# EAGLE design Enclosure 100x68 (EAGLE 9.6.1)
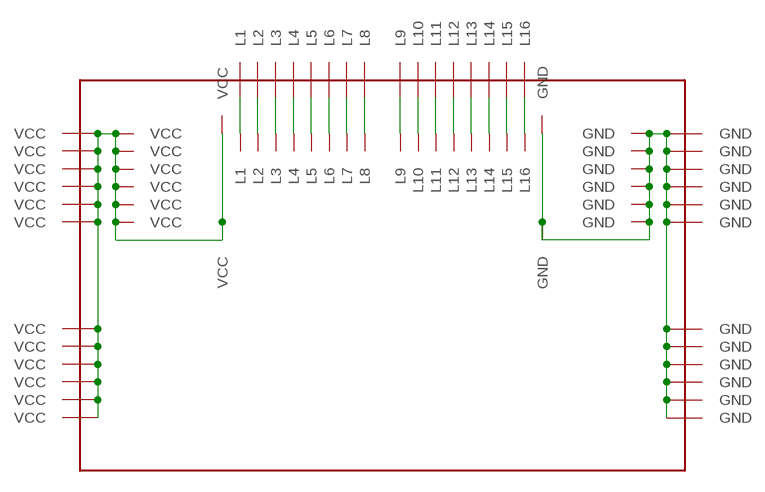
[diagram p0: schematic, sheet 1]

## Parts
P1  PROTO-34X22-BAT  [PROTO-34X22-BAT]

## Nets
GND: P1.P28-19(GND) P1.P32-16(GND) P1.P33-13(GND) P1.P33-14(GND) P1.P33-15(GND) P1.P33-16(GND) P1.P33-17(GND) P1.P33-18(GND) P1.P34-05(GND) P1.P34-06(GND) P1.P34-07(GND) P1.P34-08(GND) P1.P34-09(GND) P1.P34-10(GND) P1.P34-13(GND) P1.P34-14(GND) P1.P34-15(GND) P1.P34-16(GND) P1.P34-17(GND) P1.P34-18(GND)
N$1: P1.P10-21(L1) P1.P10-22(L1)
N$2: P1.P11-21(L2) P1.P11-22(L2)
N$3: P1.P12-21(L3) P1.P12-22(L3)
N$4: P1.P13-21(L4) P1.P13-22(L4)
N$5: P1.P14-21(L5) P1.P14-22(L5)
N$6: P1.P15-21(L6) P1.P15-22(L6)
N$7: P1.P16-21(L7) P1.P16-22(L7)
N$8: P1.P17-21(L8) P1.P17-22(L8)
N$9: P1.P18-21(L9) P1.P18-22(L9)
N$10: P1.P19-21(L10) P1.P19-22(L10)
N$11: P1.P20-21(L11) P1.P20-22(L11)
N$12: P1.P21-21(L12) P1.P21-22(L12)
N$13: P1.P22-21(L13) P1.P22-22(L13)
N$14: P1.P23-21(L14) P1.P23-22(L14)
N$15: P1.P24-21(L15) P1.P24-22(L15)
N$16: P1.P25-21(L16) P1.P25-22(L16)
VCC: P1.P01-05(VCC) P1.P01-06(VCC) P1.P01-07(VCC) P1.P01-08(VCC) P1.P01-09(VCC) P1.P01-10(VCC) P1.P01-13(VCC) P1.P01-14(VCC) P1.P01-15(VCC) P1.P01-16(VCC) P1.P01-17(VCC) P1.P01-18(VCC) P1.P02-13(VCC) P1.P02-14(VCC) P1.P02-15(VCC) P1.P02-16(VCC) P1.P02-17(VCC) P1.P02-18(VCC) P1.P03-16(VCC) P1.P06-19(VCC)

## Library data of the parts
P1 = digitalconcepts:PROTO-34X22-BAT: 34 x 22 Prototyping board, with battery connection (GND + Vcc plane), coupled side connection and Raspberry Pi Zero standoff mounting points, to fit a 100 x 68 enclosure

## Board
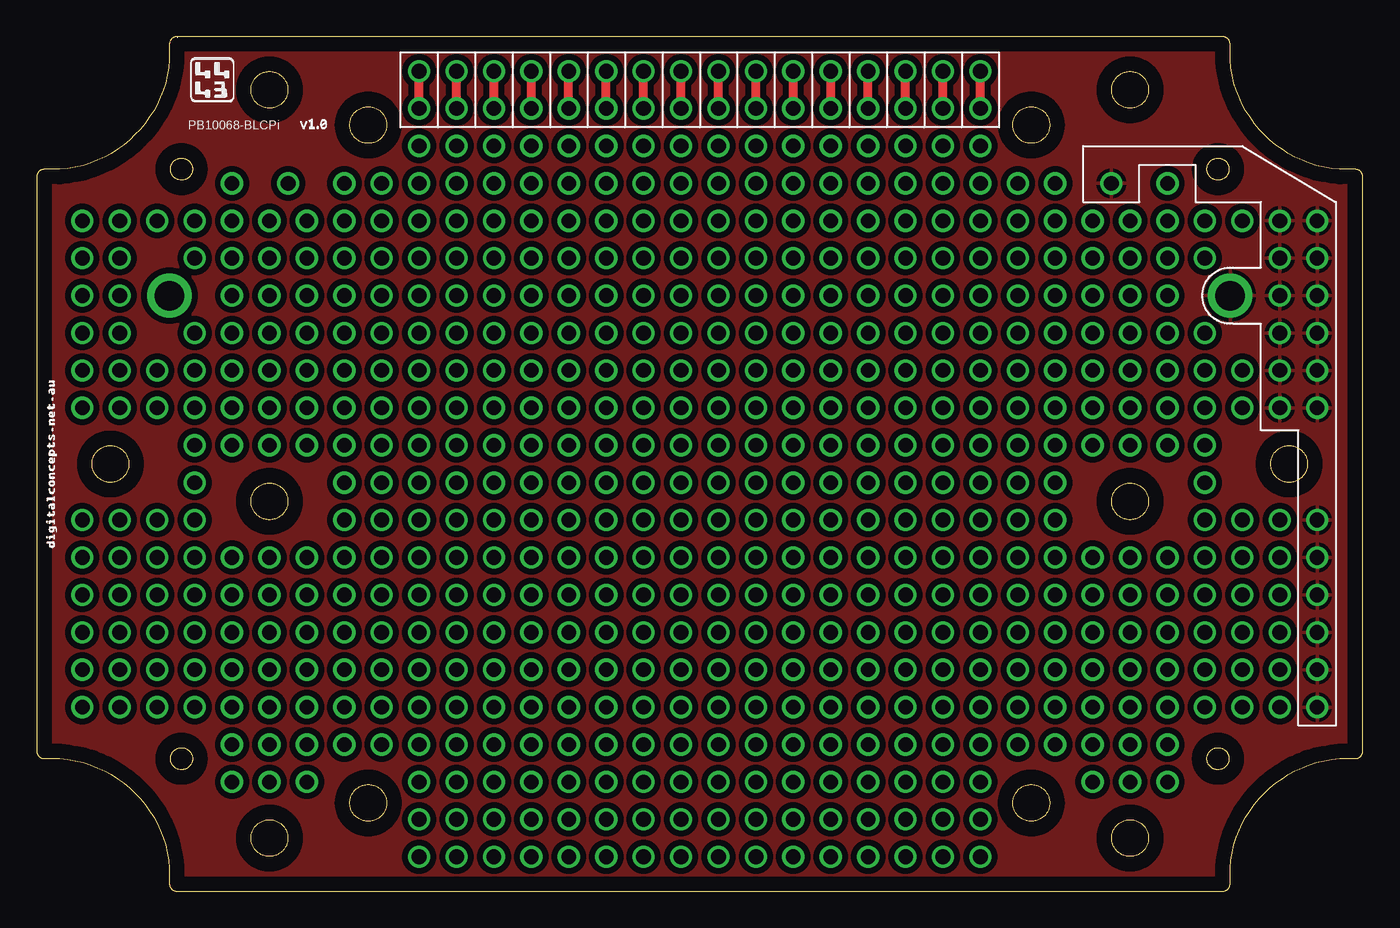
[diagram p1: board, top side]
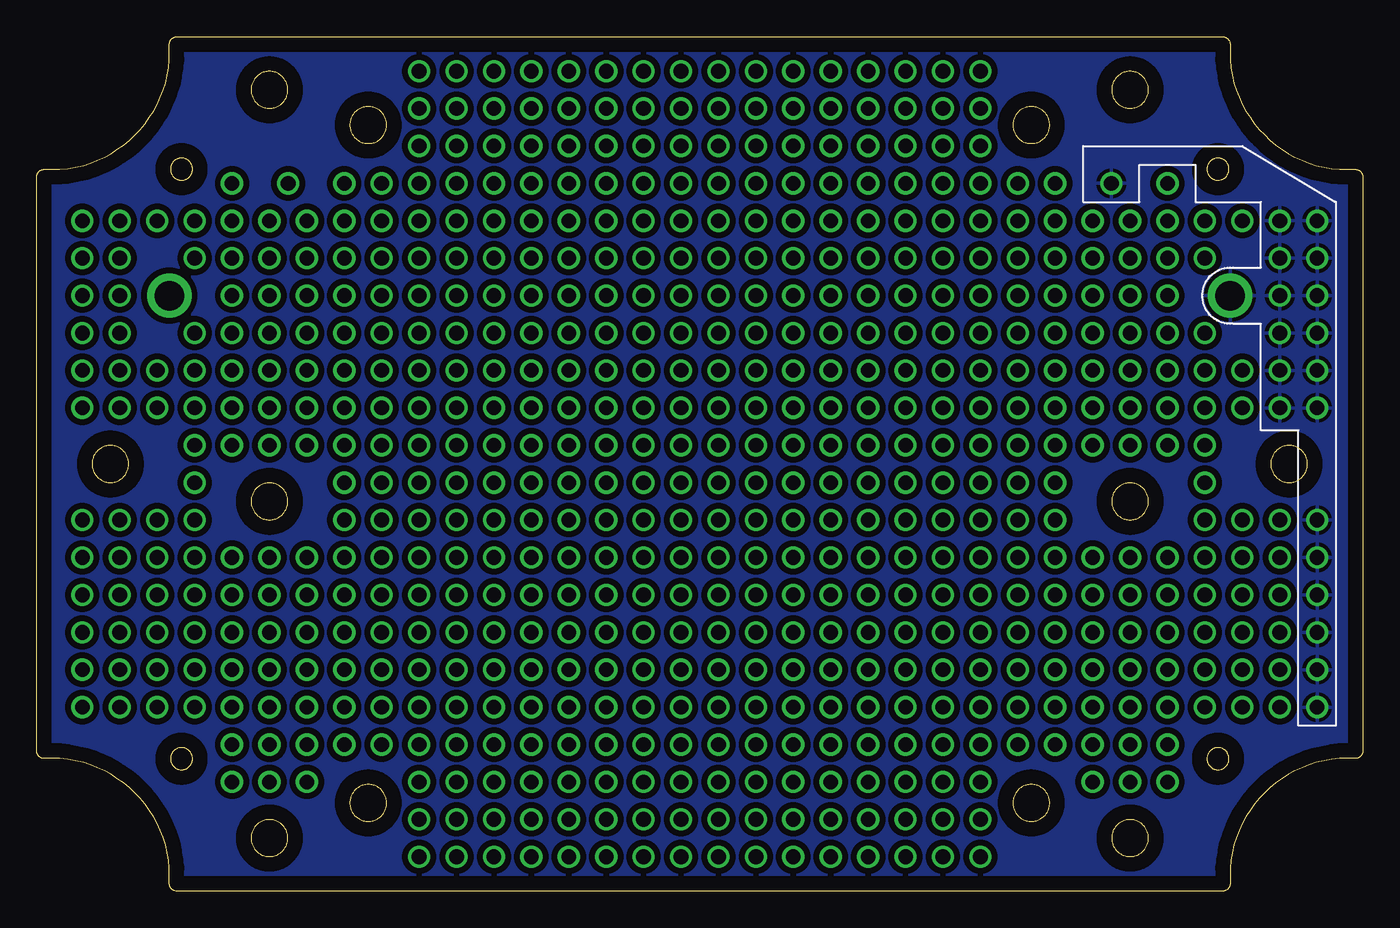
[diagram p2: board, bottom side, seen from below]

Size 90 x 58 mm. Coordinates in mm from the lower left corner, seen from the top.
Outline: 9.4,57.99 9.37,57.98 9.34,57.97 9.31,57.96 9.28,57.95 9.25,57.93 9.22,57.91 9.19,57.9 9.17,57.88 9.15,57.85 9.12,57.83 9.1,57.81 9.09,57.78 9.07,57.75 9.05,57.72 9.03,57.66 9.02,57.63 9.01,57.6 9,57.57 9,57.53 9,56.45 8.94,55.91 8.84,55.39 8.73,54.87 8.57,54.36 8.37,53.89 8.17,53.41 7.92,52.95 7.63,52.53 7.35,52.1 7.02,51.7 6.66,51.34 6.29,50.98 5.9,50.65 5.47,50.37 5.05,50.08 4.59,49.83 4.11,49.63 3.64,49.43 3.13,49.27 2.61,49.16 2.09,49.06 1.55,49 0.46,49 0.43,49 0.4,48.99 0.37,48.98 0.33,48.97 0.3,48.96 0.27,48.95 0.25,48.93 0.22,48.91 0.19,48.9 0.17,48.88 0.15,48.85 0.12,48.83 0.1,48.81 0.08,48.78 0.07,48.75 0.05,48.72 0.04,48.69 0.03,48.66 0.02,48.63 0.01,48.6 0,48.57 0,48.53 0,9.46 0,9.43 0.01,9.4 0.02,9.37 0.03,9.33 0.04,9.3 0.05,9.28 0.07,9.25 0.08,9.22 0.1,9.19 0.12,9.17 0.17,9.12 0.19,9.1 0.22,9.09 0.25,9.07 0.27,9.05 0.3,9.04 0.33,9.03 0.37,9.02 0.4,9.01 0.43,9 0.46,9 1.55,9 2.09,8.94 2.61,8.84 3.13,8.73 3.64,8.57 4.11,8.37 4.59,8.17 5.05,7.92 5.47,7.63 5.9,7.35 6.29,7.02 6.66,6.66 7.02,6.29 7.35,5.9 7.63,5.47 7.92,5.05 8.17,4.59 8.37,4.11 8.57,3.64 8.73,3.13 8.84,2.61 8.94,2.09 9,1.55 9,0.46 9,0.43 9.01,0.4 9.02,0.37 9.03,0.33 9.04,0.31 9.05,0.28 9.07,0.25 9.09,0.22 9.1,0.19 9.12,0.17 9.15,0.15 9.17,0.12 9.19,0.1 9.25,0.07 9.28,0.05 9.31,0.04 9.34,0.03 9.37,0.02 9.4,0.01 9.43,0 9.47,0 80.53,0 80.57,0 80.63,0.02 80.66,0.03 80.69,0.04 80.72,0.05 80.75,0.07 80.78,0.08 80.81,0.1 80.83,0.12 80.85,0.15 80.88,0.17 80.9,0.19 80.91,0.22 80.93,0.25 80.95,0.28 80.96,0.31 80.97,0.33 80.98,0.37 80.99,0.4 81,0.43 81,0.47 81,1.55 81.06,2.09 81.16,2.61 81.27,3.13 81.43,3.64 81.63,4.11 81.83,4.59 82.08,5.05 82.37,5.47 82.65,5.9 82.98,6.3 83.34,6.66 83.7,7.02 84.1,7.35 84.53,7.63 84.95,7.92 85.41,8.17 85.89,8.37 86.36,8.57 86.87,8.73 87.39,8.84 87.91,8.94 88.45,9 89.53,9 89.57,9 89.6,9.01 89.63,9.02 89.66,9.03 89.69,9.04 89.72,9.05 89.75,9.07 89.78,9.09 89.81,9.1 89.83,9.12 89.85,9.15 89.88,9.17 89.9,9.19 89.91,9.22 89.93,9.25 89.95,9.28 89.96,9.31 89.97,9.34 89.98,9.37 89.99,9.4 90,9.43 90,9.47 90,48.53 90,48.57 89.99,48.6 89.98,48.63 89.97,48.66 89.96,48.69 89.95,48.72 89.93,48.75 89.91,48.78 89.9,48.81 89.88,48.83 89.85,48.85 89.83,48.88 89.81,48.9 89.78,48.91 89.75,48.93 89.72,48.95 89.69,48.96 89.66,48.97 89.63,48.98 89.6,48.99 89.57,49 89.53,49 88.45,49 87.91,49.06 87.39,49.16 86.87,49.27 86.36,49.43 85.89,49.63 85.41,49.83 84.95,50.08 84.53,50.37 84.1,50.65 83.7,50.98 82.98,51.7 82.65,52.1 82.37,52.53 82.08,52.95 81.83,53.41 81.63,53.89 81.43,54.36 81.27,54.87 81.16,55.39 81.06,55.91 81,56.45 81,57.53 81,57.57 80.99,57.6 80.98,57.63 80.97,57.66 80.96,57.69 80.95,57.72 80.93,57.75 80.91,57.78 80.9,57.81 80.88,57.83 80.85,57.85 80.83,57.88 80.81,57.9 80.78,57.91 80.75,57.93 80.72,57.95 80.69,57.96 80.66,57.97 80.63,57.98 80.6,57.99 80.57,58 80.53,58 9.47,58 9.43,58 9.4,57.99
Outline: 15.54,2.37 15.46,2.39 15.38,2.42 15.3,2.45 15.23,2.48 15.16,2.52 15.09,2.56 15.02,2.61 14.96,2.66 14.91,2.72 14.85,2.77 14.8,2.83 14.75,2.9 14.71,2.97 14.67,3.04 14.64,3.11 14.61,3.19 14.58,3.27 14.56,3.35 14.55,3.43 14.54,3.51 14.54,3.69 14.55,3.77 14.56,3.85 14.58,3.93 14.61,4.01 14.64,4.09 14.67,4.16 14.71,4.23 14.75,4.3 14.8,4.36 14.85,4.43 14.91,4.48 14.96,4.54 15.02,4.59 15.09,4.64 15.16,4.68 15.23,4.72 15.3,4.75 15.38,4.78 15.46,4.81 15.54,4.82 15.62,4.84 15.7,4.85 15.88,4.85 15.96,4.84 16.04,4.82 16.12,4.81 16.2,4.78 16.28,4.75 16.35,4.72 16.42,4.68 16.49,4.64 16.55,4.59 16.62,4.54 16.67,4.48 16.73,4.43 16.78,4.36 16.83,4.3 16.87,4.23 16.91,4.16 16.94,4.09 16.97,4.01 17,3.93 17.01,3.85 17.03,3.77 17.04,3.69 17.04,3.51 17.03,3.43 17.01,3.35 17,3.27 16.97,3.19 16.94,3.11 16.91,3.04 16.87,2.97 16.83,2.9 16.78,2.83 16.73,2.77 16.67,2.72 16.62,2.66 16.55,2.61 16.49,2.56 16.42,2.52 16.35,2.48 16.28,2.45 16.2,2.42 16.12,2.39 16.04,2.37 15.96,2.36 15.88,2.35 15.7,2.35 15.62,2.36 15.54,2.37
Outline: 74.46,4.82 74.54,4.81 74.62,4.78 74.7,4.75 74.77,4.72 74.84,4.68 74.91,4.64 74.97,4.59 75.04,4.54 75.15,4.43 75.2,4.36 75.25,4.3 75.29,4.23 75.33,4.16 75.36,4.09 75.39,4.01 75.42,3.93 75.43,3.85 75.45,3.77 75.46,3.69 75.46,3.51 75.45,3.43 75.43,3.35 75.42,3.27 75.39,3.19 75.36,3.11 75.33,3.04 75.29,2.97 75.2,2.83 75.15,2.77 75.09,2.72 75.04,2.66 74.97,2.61 74.91,2.56 74.84,2.52 74.77,2.48 74.7,2.45 74.62,2.42 74.54,2.39 74.46,2.37 74.38,2.36 74.3,2.35 74.12,2.35 74.04,2.36 73.96,2.37 73.88,2.39 73.8,2.42 73.72,2.45 73.65,2.48 73.58,2.52 73.51,2.56 73.44,2.61 73.38,2.66 73.33,2.72 73.27,2.77 73.22,2.83 73.13,2.97 73.09,3.04 73.06,3.11 73.03,3.19 73,3.27 72.98,3.35 72.97,3.43 72.96,3.51 72.96,3.69 72.97,3.77 72.98,3.85 73,3.93 73.03,4.01 73.06,4.09 73.09,4.16 73.13,4.23 73.17,4.3 73.22,4.36 73.27,4.43 73.38,4.54 73.44,4.59 73.51,4.64 73.58,4.68 73.65,4.72 73.72,4.75 73.8,4.78 73.88,4.81 73.96,4.82 74.04,4.84 74.12,4.85 74.3,4.85 74.38,4.84 74.46,4.82
Outline: 67.76,7.21 67.84,7.2 67.92,7.17 67.99,7.14 68.07,7.11 68.14,7.07 68.2,7.02 68.27,6.98 68.33,6.93 68.44,6.81 68.5,6.75 68.54,6.69 68.59,6.62 68.62,6.55 68.66,6.47 68.69,6.4 68.71,6.32 68.73,6.24 68.75,6.16 68.75,6.07 68.75,5.9 68.75,5.82 68.73,5.74 68.71,5.65 68.69,5.58 68.66,5.5 68.62,5.43 68.59,5.36 68.54,5.29 68.5,5.22 68.44,5.16 68.33,5.05 68.27,5 68.14,4.91 68.07,4.87 67.99,4.84 67.92,4.8 67.84,4.78 67.76,4.76 67.67,4.75 67.59,4.74 67.42,4.74 67.33,4.75 67.25,4.76 67.17,4.78 67.09,4.8 67.02,4.84 66.94,4.87 66.87,4.91 66.74,5 66.68,5.05 66.56,5.16 66.51,5.22 66.47,5.29 66.42,5.36 66.38,5.43 66.35,5.5 66.32,5.58 66.3,5.65 66.26,5.82 66.25,5.9 66.25,6.07 66.26,6.16 66.28,6.24 66.3,6.32 66.32,6.4 66.35,6.47 66.38,6.55 66.42,6.62 66.47,6.69 66.51,6.75 66.56,6.81 66.68,6.93 66.74,6.98 66.8,7.02 66.87,7.07 66.94,7.11 67.02,7.14 67.09,7.17 67.17,7.2 67.25,7.21 67.33,7.23 67.42,7.24 67.59,7.24 67.67,7.23 67.76,7.21
Outline: 22.75,7.21 22.83,7.2 22.91,7.17 22.98,7.14 23.06,7.11 23.13,7.07 23.19,7.02 23.26,6.98 23.32,6.93 23.38,6.87 23.44,6.81 23.49,6.75 23.53,6.69 23.58,6.62 23.61,6.55 23.65,6.47 23.68,6.4 23.7,6.32 23.72,6.24 23.74,6.16 23.75,6.07 23.75,5.9 23.74,5.82 23.72,5.74 23.7,5.65 23.68,5.58 23.65,5.5 23.61,5.43 23.58,5.36 23.53,5.29 23.49,5.22 23.44,5.16 23.38,5.1 23.32,5.05 23.26,5 23.19,4.95 23.13,4.91 23.06,4.87 22.98,4.84 22.91,4.8 22.83,4.78 22.75,4.76 22.67,4.75 22.58,4.74 22.41,4.74 22.32,4.75 22.24,4.76 22.16,4.78 22.08,4.8 22.01,4.84 21.93,4.87 21.86,4.91 21.73,5 21.67,5.05 21.61,5.1 21.55,5.16 21.5,5.22 21.46,5.29 21.41,5.36 21.37,5.43 21.34,5.5 21.31,5.58 21.29,5.65 21.27,5.74 21.25,5.82 21.24,5.9 21.24,6.07 21.25,6.16 21.27,6.24 21.29,6.32 21.31,6.4 21.34,6.47 21.37,6.55 21.41,6.62 21.46,6.69 21.5,6.75 21.55,6.81 21.61,6.87 21.67,6.93 21.73,6.98 21.8,7.02 21.86,7.07 21.93,7.11 22.01,7.14 22.08,7.17 22.16,7.2 22.24,7.21 22.32,7.23 22.41,7.24 22.58,7.24 22.67,7.23 22.75,7.21
Outline: 80.33,9.72 80.38,9.71 80.43,9.69 80.47,9.68 80.52,9.66 80.56,9.63 80.6,9.61 80.64,9.58 80.67,9.55 80.71,9.51 80.74,9.48 80.77,9.44 80.8,9.4 80.83,9.36 80.85,9.32 80.87,9.28 80.89,9.23 80.9,9.18 80.91,9.14 80.92,9.09 80.93,9.04 80.93,8.93 80.92,8.88 80.91,8.83 80.9,8.78 80.89,8.74 80.87,8.69 80.85,8.65 80.83,8.61 80.8,8.57 80.77,8.53 80.74,8.49 80.71,8.45 80.67,8.42 80.64,8.39 80.6,8.36 80.56,8.34 80.52,8.31 80.47,8.29 80.43,8.27 80.38,8.26 80.33,8.25 80.28,8.24 80.23,8.23 80.13,8.23 80.08,8.24 80.03,8.25 79.98,8.26 79.93,8.27 79.89,8.29 79.84,8.31 79.8,8.34 79.76,8.36 79.72,8.39 79.68,8.42 79.65,8.45 79.61,8.49 79.58,8.53 79.56,8.57 79.53,8.61 79.51,8.65 79.49,8.69 79.47,8.74 79.45,8.78 79.44,8.83 79.43,8.88 79.43,8.93 79.43,9.04 79.43,9.09 79.44,9.14 79.45,9.18 79.47,9.23 79.51,9.32 79.53,9.36 79.56,9.4 79.58,9.44 79.61,9.48 79.65,9.51 79.68,9.55 79.72,9.58 79.8,9.63 79.84,9.66 79.89,9.68 79.93,9.69 79.98,9.71 80.03,9.72 80.08,9.73 80.13,9.73 80.23,9.73 80.28,9.73 80.33,9.72
Outline: 9.97,9.72 10.02,9.71 10.07,9.69 10.11,9.68 10.16,9.66 10.2,9.63 10.24,9.61 10.28,9.58 10.32,9.55 10.35,9.51 10.38,9.48 10.42,9.44 10.44,9.4 10.47,9.36 10.49,9.32 10.51,9.28 10.53,9.23 10.55,9.18 10.56,9.14 10.57,9.09 10.57,9.04 10.57,8.93 10.57,8.88 10.56,8.83 10.55,8.78 10.53,8.74 10.51,8.69 10.49,8.65 10.47,8.61 10.44,8.57 10.42,8.53 10.38,8.49 10.35,8.45 10.32,8.42 10.28,8.39 10.24,8.36 10.2,8.34 10.16,8.31 10.11,8.29 10.07,8.27 10.02,8.26 9.97,8.25 9.92,8.24 9.87,8.23 9.77,8.23 9.72,8.24 9.62,8.26 9.57,8.27 9.53,8.29 9.48,8.31 9.44,8.34 9.4,8.36 9.36,8.39 9.32,8.42 9.29,8.45 9.26,8.49 9.23,8.53 9.2,8.57 9.17,8.61 9.15,8.65 9.13,8.69 9.11,8.74 9.1,8.78 9.09,8.83 9.08,8.88 9.07,8.93 9.07,9.04 9.08,9.09 9.09,9.14 9.1,9.18 9.11,9.23 9.15,9.32 9.17,9.36 9.2,9.4 9.23,9.44 9.26,9.48 9.29,9.51 9.32,9.55 9.36,9.58 9.4,9.61 9.44,9.63 9.48,9.66 9.53,9.68 9.57,9.69 9.62,9.71 9.72,9.73 9.77,9.73 9.87,9.73 9.92,9.73 9.97,9.72
Outline: 15.54,25.23 15.46,25.25 15.38,25.28 15.3,25.31 15.23,25.34 15.16,25.38 15.09,25.42 15.02,25.47 14.96,25.52 14.91,25.58 14.85,25.63 14.8,25.69 14.75,25.76 14.71,25.83 14.67,25.9 14.61,26.05 14.58,26.13 14.56,26.21 14.55,26.29 14.54,26.37 14.54,26.55 14.55,26.63 14.56,26.71 14.58,26.79 14.61,26.87 14.64,26.95 14.67,27.02 14.71,27.09 14.75,27.16 14.8,27.22 14.85,27.29 14.96,27.4 15.02,27.45 15.09,27.5 15.16,27.54 15.23,27.58 15.3,27.61 15.38,27.64 15.46,27.67 15.54,27.68 15.62,27.7 15.7,27.71 15.88,27.71 15.96,27.7 16.04,27.68 16.12,27.67 16.2,27.64 16.28,27.61 16.35,27.58 16.42,27.54 16.49,27.5 16.55,27.45 16.62,27.4 16.73,27.29 16.78,27.22 16.83,27.16 16.87,27.09 16.91,27.02 16.94,26.95 16.97,26.87 17,26.79 17.01,26.71 17.03,26.63 17.04,26.55 17.04,26.37 17.03,26.29 17.01,26.21 17,26.13 16.97,26.05 16.94,25.97 16.91,25.9 16.87,25.83 16.83,25.76 16.78,25.69 16.73,25.63 16.67,25.58 16.62,25.52 16.55,25.47 16.49,25.42 16.42,25.38 16.35,25.34 16.28,25.31 16.2,25.28 16.12,25.25 16.04,25.23 15.96,25.22 15.88,25.21 15.7,25.21 15.62,25.22 15.54,25.23
Outline: 74.46,27.68 74.54,27.67 74.62,27.64 74.7,27.61 74.77,27.58 74.84,27.54 74.91,27.5 74.97,27.45 75.04,27.4 75.15,27.29 75.2,27.22 75.25,27.16 75.29,27.09 75.33,27.02 75.36,26.95 75.39,26.87 75.42,26.79 75.43,26.71 75.45,26.63 75.46,26.55 75.46,26.37 75.45,26.29 75.43,26.21 75.42,26.13 75.39,26.05 75.36,25.97 75.33,25.9 75.29,25.83 75.2,25.69 75.15,25.63 75.09,25.58 75.04,25.52 74.97,25.47 74.91,25.42 74.84,25.38 74.77,25.34 74.7,25.31 74.62,25.28 74.54,25.25 74.46,25.23 74.38,25.22 74.3,25.21 74.12,25.21 74.04,25.22 73.96,25.23 73.88,25.25 73.8,25.28 73.72,25.31 73.65,25.34 73.58,25.38 73.51,25.42 73.44,25.47 73.38,25.52 73.33,25.58 73.27,25.63 73.22,25.69 73.13,25.83 73.09,25.9 73.06,25.97 73.03,26.05 73,26.13 72.98,26.21 72.97,26.29 72.96,26.37 72.96,26.55 72.97,26.63 72.98,26.71 73,26.79 73.03,26.87 73.06,26.95 73.09,27.02 73.13,27.09 73.17,27.16 73.22,27.22 73.27,27.29 73.38,27.4 73.44,27.45 73.51,27.5 73.58,27.54 73.65,27.58 73.72,27.61 73.8,27.64 73.88,27.67 73.96,27.68 74.04,27.7 74.12,27.71 74.3,27.71 74.38,27.7 74.46,27.68
Outline: 85.26,30.22 85.34,30.21 85.42,30.18 85.49,30.15 85.57,30.12 85.64,30.08 85.77,29.99 85.83,29.94 85.89,29.88 85.94,29.83 86,29.76 86.04,29.7 86.09,29.63 86.12,29.56 86.16,29.49 86.19,29.41 86.21,29.33 86.23,29.25 86.25,29.17 86.25,29.09 86.25,28.91 86.25,28.83 86.23,28.75 86.21,28.67 86.19,28.59 86.16,28.51 86.12,28.44 86.09,28.37 86.04,28.3 86,28.23 85.94,28.17 85.89,28.12 85.83,28.06 85.77,28.01 85.7,27.96 85.64,27.92 85.57,27.88 85.42,27.82 85.34,27.79 85.26,27.77 85.17,27.76 85.09,27.75 84.92,27.75 84.83,27.76 84.75,27.77 84.67,27.79 84.59,27.82 84.52,27.85 84.44,27.88 84.37,27.92 84.31,27.96 84.24,28.01 84.18,28.06 84.12,28.12 84.06,28.17 84.01,28.23 83.97,28.3 83.92,28.37 83.88,28.44 83.85,28.51 83.82,28.59 83.8,28.67 83.78,28.75 83.76,28.83 83.75,28.91 83.75,29.09 83.76,29.17 83.78,29.25 83.8,29.33 83.82,29.41 83.85,29.49 83.88,29.56 83.92,29.63 83.97,29.7 84.01,29.76 84.06,29.83 84.12,29.88 84.18,29.94 84.24,29.99 84.31,30.04 84.37,30.08 84.44,30.12 84.52,30.15 84.59,30.18 84.67,30.21 84.75,30.22 84.83,30.24 84.92,30.25 85.09,30.25 85.17,30.24 85.26,30.22
Outline: 5.25,30.22 5.33,30.21 5.41,30.18 5.48,30.15 5.56,30.12 5.63,30.08 5.76,29.99 5.82,29.94 5.88,29.88 5.93,29.83 5.99,29.76 6.03,29.7 6.08,29.63 6.11,29.56 6.15,29.49 6.18,29.41 6.2,29.33 6.22,29.25 6.24,29.17 6.24,29.09 6.24,28.91 6.24,28.83 6.22,28.75 6.2,28.67 6.18,28.59 6.15,28.51 6.11,28.44 6.08,28.37 6.03,28.3 5.99,28.23 5.93,28.17 5.88,28.12 5.82,28.06 5.76,28.01 5.69,27.96 5.63,27.92 5.56,27.88 5.48,27.85 5.41,27.82 5.33,27.79 5.25,27.77 5.17,27.76 5.08,27.75 4.91,27.75 4.82,27.76 4.74,27.77 4.66,27.79 4.58,27.82 4.51,27.85 4.43,27.88 4.36,27.92 4.3,27.96 4.23,28.01 4.17,28.06 4.11,28.12 4.05,28.17 4,28.23 3.96,28.3 3.91,28.37 3.87,28.44 3.84,28.51 3.81,28.59 3.79,28.67 3.77,28.75 3.75,28.83 3.74,28.91 3.74,29.09 3.75,29.17 3.77,29.25 3.79,29.33 3.81,29.41 3.87,29.56 3.91,29.63 3.96,29.7 4,29.76 4.05,29.83 4.11,29.88 4.17,29.94 4.23,29.99 4.36,30.08 4.43,30.12 4.51,30.15 4.58,30.18 4.66,30.21 4.74,30.22 4.82,30.24 4.91,30.25 5.08,30.25 5.17,30.24 5.25,30.22
Outline: 80.33,49.75 80.38,49.74 80.43,49.72 80.47,49.71 80.52,49.69 80.56,49.66 80.6,49.64 80.64,49.61 80.67,49.58 80.74,49.51 80.77,49.47 80.8,49.43 80.83,49.39 80.85,49.35 80.87,49.31 80.89,49.26 80.9,49.21 80.91,49.17 80.92,49.12 80.93,49.07 80.93,48.96 80.92,48.91 80.91,48.86 80.9,48.81 80.89,48.77 80.87,48.72 80.85,48.68 80.83,48.64 80.8,48.6 80.77,48.56 80.74,48.52 80.67,48.45 80.64,48.42 80.6,48.39 80.56,48.37 80.52,48.34 80.47,48.32 80.43,48.3 80.38,48.29 80.33,48.28 80.28,48.27 80.23,48.26 80.13,48.26 80.08,48.27 80.03,48.28 79.98,48.29 79.93,48.3 79.89,48.32 79.84,48.34 79.8,48.37 79.72,48.42 79.68,48.45 79.65,48.48 79.61,48.52 79.58,48.56 79.56,48.6 79.53,48.64 79.51,48.68 79.47,48.77 79.45,48.81 79.44,48.86 79.43,48.91 79.43,48.96 79.43,49.07 79.43,49.12 79.44,49.17 79.45,49.21 79.47,49.26 79.49,49.31 79.51,49.35 79.53,49.39 79.56,49.43 79.58,49.47 79.61,49.51 79.65,49.54 79.68,49.58 79.72,49.61 79.8,49.66 79.84,49.69 79.89,49.71 79.93,49.72 79.98,49.74 80.03,49.75 80.08,49.76 80.13,49.76 80.23,49.76 80.28,49.76 80.33,49.75
Outline: 9.97,49.75 10.02,49.74 10.07,49.72 10.11,49.71 10.16,49.69 10.2,49.66 10.24,49.64 10.28,49.61 10.32,49.58 10.35,49.54 10.38,49.51 10.42,49.47 10.44,49.43 10.47,49.39 10.49,49.35 10.51,49.31 10.53,49.26 10.55,49.21 10.56,49.17 10.57,49.12 10.57,49.07 10.57,48.96 10.57,48.91 10.56,48.86 10.55,48.81 10.53,48.77 10.51,48.72 10.49,48.68 10.47,48.64 10.44,48.6 10.42,48.56 10.38,48.52 10.35,48.48 10.32,48.45 10.28,48.42 10.24,48.39 10.2,48.37 10.16,48.34 10.11,48.32 10.07,48.3 10.02,48.29 9.97,48.28 9.92,48.27 9.87,48.26 9.77,48.26 9.72,48.27 9.62,48.29 9.57,48.3 9.53,48.32 9.48,48.34 9.44,48.37 9.4,48.39 9.36,48.42 9.32,48.45 9.29,48.48 9.26,48.52 9.23,48.56 9.2,48.6 9.17,48.64 9.15,48.68 9.11,48.77 9.1,48.81 9.09,48.86 9.08,48.91 9.07,48.96 9.07,49.07 9.08,49.12 9.09,49.17 9.1,49.21 9.11,49.26 9.13,49.31 9.15,49.35 9.17,49.39 9.2,49.43 9.23,49.47 9.26,49.51 9.29,49.54 9.32,49.58 9.36,49.61 9.4,49.64 9.44,49.66 9.48,49.69 9.53,49.71 9.57,49.72 9.62,49.74 9.67,49.75 9.72,49.76 9.77,49.76 9.87,49.76 9.92,49.76 9.97,49.75
Outline: 22.24,50.79 22.16,50.8 22.08,50.83 22.01,50.86 21.93,50.89 21.86,50.93 21.8,50.98 21.73,51.02 21.67,51.07 21.61,51.13 21.55,51.19 21.5,51.25 21.46,51.31 21.41,51.38 21.37,51.45 21.34,51.53 21.31,51.6 21.29,51.68 21.27,51.76 21.25,51.84 21.24,51.93 21.24,52.1 21.25,52.18 21.27,52.26 21.29,52.35 21.31,52.42 21.34,52.5 21.37,52.57 21.41,52.64 21.46,52.71 21.5,52.78 21.55,52.84 21.61,52.9 21.67,52.95 21.73,53 21.8,53.05 21.86,53.09 21.93,53.13 22.08,53.2 22.16,53.22 22.24,53.24 22.32,53.25 22.41,53.26 22.58,53.26 22.67,53.25 22.75,53.24 22.83,53.22 22.91,53.2 23.06,53.13 23.13,53.09 23.19,53.05 23.26,53 23.32,52.95 23.38,52.9 23.44,52.84 23.49,52.78 23.53,52.71 23.58,52.64 23.61,52.57 23.65,52.5 23.68,52.42 23.7,52.35 23.72,52.26 23.74,52.18 23.75,52.1 23.75,51.93 23.74,51.84 23.72,51.76 23.7,51.68 23.68,51.6 23.61,51.45 23.58,51.38 23.53,51.31 23.49,51.25 23.44,51.19 23.38,51.13 23.32,51.07 23.26,51.02 23.19,50.98 23.13,50.93 23.06,50.89 22.98,50.86 22.91,50.83 22.83,50.8 22.75,50.79 22.67,50.77 22.58,50.76 22.41,50.76 22.32,50.77 22.24,50.79
Outline: 68.44,52.84 68.5,52.78 68.54,52.71 68.59,52.64 68.62,52.57 68.66,52.5 68.69,52.42 68.71,52.35 68.73,52.26 68.75,52.18 68.75,52.1 68.75,51.93 68.75,51.84 68.73,51.76 68.71,51.68 68.69,51.6 68.66,51.53 68.62,51.45 68.59,51.38 68.54,51.31 68.5,51.25 68.44,51.19 68.33,51.07 68.27,51.02 68.2,50.98 68.14,50.93 68.07,50.89 67.99,50.86 67.92,50.83 67.84,50.8 67.76,50.79 67.67,50.77 67.59,50.76 67.42,50.76 67.33,50.77 67.25,50.79 67.17,50.8 67.09,50.83 67.02,50.86 66.94,50.89 66.87,50.93 66.8,50.98 66.74,51.02 66.68,51.07 66.56,51.19 66.51,51.25 66.47,51.31 66.42,51.38 66.38,51.45 66.35,51.53 66.32,51.6 66.3,51.68 66.28,51.76 66.26,51.84 66.25,51.93 66.25,52.1 66.26,52.18 66.3,52.35 66.32,52.42 66.35,52.5 66.38,52.57 66.42,52.64 66.47,52.71 66.51,52.78 66.56,52.84 66.68,52.95 66.74,53 66.8,53.05 66.87,53.09 66.94,53.13 67.02,53.16 67.09,53.2 67.17,53.22 67.25,53.24 67.33,53.25 67.42,53.26 67.59,53.26 67.67,53.25 67.76,53.24 67.84,53.22 67.92,53.2 67.99,53.16 68.07,53.13 68.14,53.09 68.2,53.05 68.27,53 68.33,52.95 68.44,52.84
Outline: 74.46,55.62 74.54,55.61 74.62,55.58 74.7,55.55 74.77,55.52 74.84,55.48 74.91,55.44 74.97,55.39 75.04,55.34 75.09,55.28 75.15,55.23 75.2,55.16 75.29,55.03 75.33,54.96 75.36,54.89 75.39,54.81 75.42,54.73 75.43,54.65 75.45,54.57 75.46,54.49 75.46,54.31 75.45,54.23 75.43,54.15 75.42,54.07 75.39,53.99 75.36,53.91 75.33,53.84 75.29,53.77 75.2,53.63 75.15,53.57 75.09,53.52 75.04,53.46 74.97,53.41 74.91,53.36 74.84,53.32 74.77,53.28 74.7,53.25 74.62,53.22 74.54,53.19 74.46,53.17 74.38,53.16 74.3,53.15 74.12,53.15 74.04,53.16 73.96,53.17 73.88,53.19 73.8,53.22 73.72,53.25 73.65,53.28 73.58,53.32 73.51,53.36 73.44,53.41 73.38,53.46 73.33,53.52 73.27,53.57 73.22,53.63 73.13,53.77 73.09,53.84 73.06,53.91 73.03,53.99 73,54.07 72.98,54.15 72.97,54.23 72.96,54.31 72.96,54.49 72.97,54.57 72.98,54.65 73,54.73 73.03,54.81 73.06,54.89 73.09,54.96 73.13,55.03 73.22,55.16 73.27,55.23 73.33,55.28 73.38,55.34 73.44,55.39 73.51,55.44 73.58,55.48 73.65,55.52 73.72,55.55 73.8,55.58 73.88,55.61 73.96,55.62 74.04,55.64 74.12,55.65 74.3,55.65 74.38,55.64 74.46,55.62
Outline: 16.04,55.62 16.12,55.61 16.2,55.58 16.28,55.55 16.35,55.52 16.42,55.48 16.49,55.44 16.55,55.39 16.62,55.34 16.67,55.28 16.73,55.23 16.78,55.16 16.83,55.1 16.87,55.03 16.91,54.96 16.94,54.89 16.97,54.81 17,54.73 17.01,54.65 17.03,54.57 17.04,54.49 17.04,54.31 17.03,54.23 17.01,54.15 17,54.07 16.97,53.99 16.94,53.91 16.91,53.84 16.87,53.77 16.83,53.7 16.78,53.63 16.73,53.57 16.67,53.52 16.62,53.46 16.55,53.41 16.49,53.36 16.42,53.32 16.35,53.28 16.28,53.25 16.2,53.22 16.12,53.19 16.04,53.17 15.96,53.16 15.88,53.15 15.7,53.15 15.62,53.16 15.54,53.17 15.46,53.19 15.38,53.22 15.3,53.25 15.23,53.28 15.16,53.32 15.09,53.36 15.02,53.41 14.96,53.46 14.91,53.52 14.85,53.57 14.8,53.63 14.75,53.7 14.71,53.77 14.67,53.84 14.64,53.91 14.61,53.99 14.58,54.07 14.56,54.15 14.55,54.23 14.54,54.31 14.54,54.49 14.55,54.57 14.56,54.65 14.58,54.73 14.61,54.81 14.64,54.89 14.67,54.96 14.71,55.03 14.75,55.1 14.8,55.16 14.85,55.23 14.91,55.28 14.96,55.34 15.02,55.39 15.09,55.44 15.16,55.48 15.23,55.52 15.3,55.55 15.38,55.58 15.46,55.61 15.54,55.62 15.62,55.64 15.7,55.65 15.88,55.65 15.96,55.64 16.04,55.62
Copper layers (1*16): Top 0.035mm / dielectric 1.5mm / Bottom 0.035mm
Design rules "default": minimum track width 6mil, minimum drill 0.35mm, track to track 6mil, track to pad 6mil, pad to pad 6mil, via to via 6mil, smd to smd 6mil, copper to edge 40mil, drill to drill 6mil, minimum pad ring 10mil, minimum via ring 8mil, stop-mask expansion 4mil, vias tented up to drill 0mil, thermal gap 10mil

### Footprints (pad centres in the part's own frame; a part is rotated, then mirrored left to right if it is on the bottom)
PROTO-34X22-BAT = drill 1: P01-05 -16.51,41.91; P01-06 -13.97,41.91; P01-07 -11.43,41.91; P01-08 -8.89,41.91; P01-09 -6.35,41.91; P01-10 -3.81,41.91; P01-13 3.81,41.91; P01-14 6.35,41.91; P01-15 8.89,41.91; P01-16 11.43,41.91; P01-17 13.97,41.91; P01-18 16.51,41.91; P02-05 -16.51,39.37; P02-10 -3.81,39.37; P02-13 3.81,39.37; P02-14 6.35,39.37; P02-15 8.89,39.37; P02-16 11.43,39.37; P02-17 13.97,39.37; P02-18 16.51,39.37; P03-05 -16.51,36.83; P03-10 -3.81,36.83; P03-13 3.81,36.83; P03-14 6.35,36.83; P03-18 16.51,36.83; P04-05 -16.51,34.29; P04-09 -6.35,34.29; P04-10 -3.81,34.29; P04-11 -1.27,34.29; P04-12 1.27,34.29; P04-13 3.81,34.29; P04-14 6.35,34.29; P04-15 8.89,34.29; P04-17 13.97,34.29; P04-18 16.51,34.29; P05-03 -21.59,31.75; P05-04 -19.05,31.75; P05-09 -6.35,31.75; P05-12 1.27,31.75; P05-15 8.89,31.75; P05-16 11.43,31.75; P05-17 13.97,31.75; P05-18 16.51,31.75; P05-19 19.05,31.75; P06-03 -21.59,29.21; P06-04 -19.05,29.21; P06-09 -6.35,29.21; P06-12 1.27,29.21; P06-18 16.51,29.21; P06-19 19.05,27.94; P07-03 -21.59,26.67; P07-04 -19.05,26.67; P07-09 -6.35,26.67; P07-12 1.27,26.67; P07-18 16.51,26.67; P08-04 -19.05,24.13; P08-09 -6.35,24.13; P08-10 -3.81,24.13; P08-11 -1.27,24.13; P08-12 1.27,24.13; P08-18 16.51,24.13; P08-19 19.05,24.13; P09-04 -19.05,21.59; P09-18 16.51,21.59; P09-19 19.05,21.59; P10-01 -26.67,19.05; P10-02 -24.13,19.05; P10-03 -21.59,19.05; P10-04 -19.05,19.05; P10-18 16.51,19.05; P10-19 19.05,19.05; P10-20 21.59,19.05; P10-21 24.13,19.05; P10-22 26.67,19.05; P11-01 -26.67,16.51; P11-21 24.13,16.51; P11-22 26.67,16.51; P12-01 -26.67,13.97; P12-21 24.13,13.97; P12-22 26.67,13.97; P13-01 -26.67,11.43; P13-21 24.13,11.43; P13-22 26.67,11.43; P14-01 -26.67,8.89; P14-21 24.13,8.89; P14-22 26.67,8.89; P15-01 -26.67,6.35; P15-21 24.13,6.35; P15-22 26.67,6.35; P16-01 -26.67,3.81; P16-21 24.13,3.81; P16-22 26.67,3.81; P17-01 -26.67,1.27; P17-21 24.13,1.27; P17-22 26.67,1.27; P18-01 -26.67,-1.27; P18-21 24.13,-1.27; P18-22 26.67,-1.27; P19-01 -26.67,-3.81; P19-21 24.13,-3.81; P19-22 26.67,-3.81; P20-01 -26.67,-6.35; P20-21 24.13,-6.35; P20-22 26.67,-6.35; P21-01 -26.67,-8.89; P21-21 24.13,-8.89; P21-22 26.67,-8.89; P22-01 -26.67,-11.43; P22-21 24.13,-11.43; P22-22 26.67,-11.43; P23-01 -26.67,-13.97; P23-21 24.13,-13.97; P23-22 26.67,-13.97; P24-01 -26.67,-16.51; P24-21 24.13,-16.51; P24-22 26.67,-16.51; P25-01 -26.67,-19.05; P25-02 -24.13,-19.05; P25-03 -21.59,-19.05; P25-04 -19.05,-19.05; P25-19 19.05,-19.05; P25-20 21.59,-19.05; P25-21 24.13,-19.05; P25-22 26.67,-19.05; P26-04 -19.05,-21.59; P26-19 19.05,-21.59; P27-04 -19.05,-24.13; P27-09 -6.35,-24.13; P27-10 -3.81,-24.13; P27-11 -1.27,-24.13; P27-12 1.27,-24.13; P27-18 16.51,-24.13; P27-19 19.05,-24.13; P28-03 -21.59,-26.67; P28-04 -19.05,-26.67; P28-09 -6.35,-26.67; P28-12 1.27,-26.67; P28-18 16.51,-26.67; P28-19 19.05,-27.94; P29-03 -21.59,-29.21; P29-04 -19.05,-29.21; P29-09 -6.35,-29.21; P29-12 1.27,-29.21; P29-14 6.35,-29.21; P29-15 8.89,-29.21; P29-16 11.43,-29.21; P29-17 13.97,-29.21; P29-18 16.51,-29.21; P30-03 -21.59,-31.75; P30-04 -19.05,-31.75; P30-05 -16.51,-31.75; P30-09 -6.35,-31.75; P30-12 1.27,-31.75; P30-14 6.35,-31.75; P30-15 8.89,-31.75; P30-16 11.43,-31.75; P30-17 13.97,-31.75; P30-18 16.51,-31.75; P30-19 19.05,-31.75; P31-05 -16.51,-34.29; P31-09 -6.35,-34.29; P31-10 -3.81,-34.29; P31-11 -1.27,-34.29; P31-12 1.27,-34.29; P31-13 3.81,-34.29; P31-14 6.35,-34.29; P31-15 8.89,-34.29; P31-17 13.97,-34.29; P31-18 16.51,-34.29; P32-05 -16.51,-36.83; P32-10 -3.81,-36.83; P32-13 3.81,-36.83; P32-14 6.35,-36.83; P32-18 16.51,-36.83; P33-05 -16.51,-39.37; P33-10 -3.81,-39.37; P33-13 3.81,-39.37; P33-14 6.35,-39.37; P33-15 8.89,-39.37; P33-16 11.43,-39.37; P33-17 13.97,-39.37; P33-18 16.51,-39.37; P34-05 -16.51,-41.91; P34-06 -13.97,-41.91; P34-07 -11.43,-41.91; P34-08 -8.89,-41.91; P34-09 -6.35,-41.91; P34-10 -3.81,-41.91; P34-13 3.81,-41.91; P34-14 6.35,-41.91; P34-15 8.89,-41.91; P34-16 11.43,-41.91; P34-17 13.97,-41.91; P34-18 16.51,-41.91; P44 -24.13,-16.51; P45 -24.13,-13.97; P46 -24.13,-11.43; P47 -24.13,-8.89; P48 -24.13,-6.35; P49 -24.13,-3.81; P50 -24.13,-1.27; P51 -24.13,1.27; P52 -24.13,3.81; P53 -24.13,6.35; P54 -24.13,8.89; P55 -24.13,11.43; P56 -24.13,13.97; P57 -24.13,16.51; P78 -21.59,16.51; P79 -21.59,13.97; P80 -21.59,11.43; P81 -21.59,8.89; P82 -21.59,6.35; P83 -21.59,3.81; P84 -21.59,1.27; P85 -21.59,-1.27; P86 -21.59,-3.81; P87 -21.59,-6.35; P88 -21.59,-8.89; P89 -21.59,-11.43; P90 -21.59,-13.97; P91 -21.59,-16.51; P112 -19.05,-16.51; P113 -19.05,-13.97; P114 -19.05,-11.43; P115 -19.05,-8.89; P116 -19.05,-6.35; P117 -19.05,-3.81; P118 -19.05,-1.27; P119 -19.05,1.27; P120 -19.05,3.81; P121 -19.05,6.35; P122 -19.05,8.89; P123 -19.05,11.43; P124 -19.05,13.97; P125 -19.05,16.51; P140 -16.51,31.75; P141 -16.51,29.21; P142 -16.51,26.67; P143 -16.51,24.13; P144 -16.51,21.59; P145 -16.51,19.05; P146 -16.51,16.51; P147 -16.51,13.97; P148 -16.51,11.43; P149 -16.51,8.89; P150 -16.51,6.35; P151 -16.51,3.81; P152 -16.51,1.27; P153 -16.51,-1.27; P154 -16.51,-3.81; P155 -16.51,-6.35; P156 -16.51,-8.89; P157 -16.51,-11.43; P158 -16.51,-13.97; P159 -16.51,-16.51; P160 -16.51,-19.05; P161 -16.51,-21.59; P162 -16.51,-24.13; P163 -16.51,-26.67; P164 -16.51,-29.21; P171 -13.97,-39.37; P172 -13.97,-36.83; P173 -13.97,-34.29; P174 -13.97,-31.75; P175 -13.97,-29.21; P176 -13.97,-26.67; P177 -13.97,-24.13; P178 -13.97,-21.59; P179 -13.97,-19.05; P180 -13.97,-16.51; P181 -13.97,-13.97; P182 -13.97,-11.43; P183 -13.97,-8.89; P184 -13.97,-6.35; P185 -13.97,-3.81; P186 -13.97,-1.27; P187 -13.97,1.27; P188 -13.97,3.81; P189 -13.97,6.35; P190 -13.97,8.89; P191 -13.97,11.43; P192 -13.97,13.97; P193 -13.97,16.51; P194 -13.97,19.05; P195 -13.97,21.59; P196 -13.97,24.13; P197 -13.97,26.67; P198 -13.97,29.21; P199 -13.97,31.75; P200 -13.97,34.29; P201 -13.97,36.83; P202 -13.97,39.37; P205 -11.43,39.37; P206 -11.43,36.83; P207 -11.43,34.29; P208 -11.43,31.75; P209 -11.43,29.21; P210 -11.43,26.67; P211 -11.43,24.13; P212 -11.43,21.59; P213 -11.43,19.05; P214 -11.43,16.51; P215 -11.43,13.97; P216 -11.43,11.43; P217 -11.43,8.89; P218 -11.43,6.35; P219 -11.43,3.81; P220 -11.43,1.27; P221 -11.43,-1.27; P222 -11.43,-3.81; P223 -11.43,-6.35; P224 -11.43,-8.89; P225 -11.43,-11.43; P226 -11.43,-13.97; P227 -11.43,-16.51; P228 -11.43,-19.05; P229 -11.43,-21.59; P230 -11.43,-24.13; P231 -11.43,-26.67; P232 -11.43,-29.21; P233 -11.43,-31.75; P234 -11.43,-34.29; P235 -11.43,-36.83; P236 -11.43,-39.37; P239 -8.89,-39.37; P240 -8.89,-36.83; P241 -8.89,-34.29; P242 -8.89,-31.75; P243 -8.89,-29.21; P244 -8.89,-26.67; P245 -8.89,-24.13; P246 -8.89,-21.59; P247 -8.89,-19.05; P248 -8.89,-16.51; P249 -8.89,-13.97; P250 -8.89,-11.43; P251 -8.89,-8.89; P252 -8.89,-6.35; P253 -8.89,-3.81; P254 -8.89,-1.27; P255 -8.89,1.27; P256 -8.89,3.81; P257 -8.89,6.35; P258 -8.89,8.89; P259 -8.89,11.43; P260 -8.89,13.97; P261 -8.89,16.51; P262 -8.89,19.05; P263 -8.89,21.59; P264 -8.89,24.13; P265 -8.89,26.67; P266 -8.89,29.21; P267 -8.89,31.75; P268 -8.89,34.29; P269 -8.89,36.83; P270 -8.89,39.37; P273 -6.35,39.37; P274 -6.35,36.83; P280 -6.35,21.59; P281 -6.35,19.05; P282 -6.35,16.51; P283 -6.35,13.97; P284 -6.35,11.43; P285 -6.35,8.89; P286 -6.35,6.35; P287 -6.35,3.81; P288 -6.35,1.27; P289 -6.35,-1.27; P290 -6.35,-3.81; P291 -6.35,-6.35; P292 -6.35,-8.89; P293 -6.35,-11.43; P294 -6.35,-13.97; P295 -6.35,-16.51; P296 -6.35,-19.05; P297 -6.35,-21.59; P303 -6.35,-36.83; P304 -6.35,-39.37; P314 -3.81,-21.59; P315 -3.81,-19.05; P316 -3.81,-16.51; P317 -3.81,-13.97; P318 -3.81,-11.43; P319 -3.81,-8.89; P320 -3.81,-6.35; P321 -3.81,-3.81; P322 -3.81,-1.27; P323 -3.81,1.27; P324 -3.81,3.81; P325 -3.81,6.35; P326 -3.81,8.89; P327 -3.81,11.43; P328 -3.81,13.97; P329 -3.81,16.51; P330 -3.81,19.05; P331 -3.81,21.59; P348 -1.27,21.59; P349 -1.27,19.05; P350 -1.27,16.51; P351 -1.27,13.97; P352 -1.27,11.43; P353 -1.27,8.89; P354 -1.27,6.35; P355 -1.27,3.81; P356 -1.27,1.27; P357 -1.27,-1.27; P358 -1.27,-3.81; P359 -1.27,-6.35; P360 -1.27,-8.89; P361 -1.27,-11.43; P362 -1.27,-13.97; P363 -1.27,-16.51; P364 -1.27,-19.05; P365 -1.27,-21.59; P382 1.27,-21.59; P383 1.27,-19.05; P384 1.27,-16.51; P385 1.27,-13.97; P386 1.27,-11.43; P387 1.27,-8.89; P388 1.27,-6.35; P389 1.27,-3.81; P390 1.27,-1.27; P391 1.27,1.27; P392 1.27,3.81; P393 1.27,6.35; P394 1.27,8.89; P395 1.27,11.43; P396 1.27,13.97; P397 1.27,16.51; P398 1.27,19.05; P399 1.27,21.59; P412 3.81,31.75; P413 3.81,29.21; P414 3.81,26.67; P415 3.81,24.13; P416 3.81,21.59; P417 3.81,19.05; P418 3.81,16.51; P419 3.81,13.97; P420 3.81,11.43; P421 3.81,8.89; P422 3.81,6.35; P423 3.81,3.81; P424 3.81,1.27; P425 3.81,-1.27; P426 3.81,-3.81; P427 3.81,-6.35; P428 3.81,-8.89; P429 3.81,-11.43; P430 3.81,-13.97; P431 3.81,-16.51; P432 3.81,-19.05; P433 3.81,-21.59; P434 3.81,-24.13; P435 3.81,-26.67; P436 3.81,-29.21; P437 3.81,-31.75; P448 6.35,-26.67; P449 6.35,-24.13; P450 6.35,-21.59; P451 6.35,-19.05; P452 6.35,-16.51; P453 6.35,-13.97; P454 6.35,-11.43; P455 6.35,-8.89; P456 6.35,-6.35; P457 6.35,-3.81; P458 6.35,-1.27; P459 6.35,1.27; P460 6.35,3.81; P461 6.35,6.35; P462 6.35,8.89; P463 6.35,11.43; P464 6.35,13.97; P465 6.35,16.51; P466 6.35,19.05; P467 6.35,21.59; P468 6.35,24.13; P469 6.35,26.67; P470 6.35,29.21; P471 6.35,31.75; P481 8.89,29.21; P482 8.89,26.67; P483 8.89,24.13; P484 8.89,21.59; P485 8.89,19.05; P486 8.89,16.51; P487 8.89,13.97; P488 8.89,11.43; P489 8.89,8.89; P490 8.89,6.35; P491 8.89,3.81; P492 8.89,1.27; P493 8.89,-1.27; P494 8.89,-3.81; P495 8.89,-6.35; P496 8.89,-8.89; P497 8.89,-11.43; P498 8.89,-13.97; P499 8.89,-16.51; P500 8.89,-19.05; P501 8.89,-21.59; P502 8.89,-24.13; P503 8.89,-26.67; P516 11.43,-26.67; P517 11.43,-24.13; P518 11.43,-21.59; P519 11.43,-19.05; P520 11.43,-16.51; P521 11.43,-13.97; P522 11.43,-11.43; P523 11.43,-8.89; P524 11.43,-6.35; P525 11.43,-3.81; P526 11.43,-1.27; P527 11.43,1.27; P528 11.43,3.81; P529 11.43,6.35; P530 11.43,8.89; P531 11.43,11.43; P532 11.43,13.97; P533 11.43,16.51; P534 11.43,19.05; P535 11.43,21.59; P536 11.43,24.13; P537 11.43,26.67; P538 11.43,29.21; P549 13.97,29.21; P550 13.97,26.67; P551 13.97,24.13; P552 13.97,21.59; P553 13.97,19.05; P554 13.97,16.51; P555 13.97,13.97; P556 13.97,11.43; P557 13.97,8.89; P558 13.97,6.35; P559 13.97,3.81; P560 13.97,1.27; P561 13.97,-1.27; P562 13.97,-3.81; P563 13.97,-6.35; P564 13.97,-8.89; P565 13.97,-11.43; P566 13.97,-13.97; P567 13.97,-16.51; P568 13.97,-19.05; P569 13.97,-21.59; P570 13.97,-24.13; P571 13.97,-26.67; P586 16.51,-21.59; P587 16.51,-19.05; P588 16.51,-16.51; P589 16.51,-13.97; P590 16.51,-11.43; P591 16.51,-8.89; P592 16.51,-6.35; P593 16.51,-3.81; P594 16.51,-1.27; P595 16.51,1.27; P596 16.51,3.81; P597 16.51,6.35; P598 16.51,8.89; P599 16.51,11.43; P600 16.51,13.97; P601 16.51,16.51; P622 19.05,16.51; P623 19.05,13.97; P624 19.05,11.43; P625 19.05,8.89; P626 19.05,6.35; P627 19.05,3.81; P628 19.05,1.27; P629 19.05,-1.27; P630 19.05,-3.81; P631 19.05,-6.35; P632 19.05,-8.89; P633 19.05,-11.43; P634 19.05,-13.97; P635 19.05,-16.51; P656 21.59,-16.51; P657 21.59,-13.97; P658 21.59,-11.43; P659 21.59,-8.89; P660 21.59,-6.35; P661 21.59,-3.81; P662 21.59,-1.27; P663 21.59,1.27; P664 21.59,3.81; P665 21.59,6.35; P666 21.59,8.89; P667 21.59,11.43; P668 21.59,13.97; P669 21.59,16.51 | drill 2: P03-16 11.43,36.005; P32-16 11.43,-36.005

### Placement (x,y rotation side)
P1  45,29 90 top

### Tracks (layer width: path | path; a pad name or v marks a point on that pad's centre or on a via)
GND
  pour Top (isolate 0.406): -1.48,59.48 -1.48,-1.48 91.61,-1.48 91.61,59.48
N$1
  Top 0.61: P1.P10-21 P1.P10-22
N$2
  Top 0.61: P1.P11-21 P1.P11-22
N$3
  Top 0.61: P1.P12-21 P1.P12-22
N$4
  Top 0.61: P1.P13-21 P1.P13-22
N$5
  Top 0.61: P1.P14-21 P1.P14-22
N$6
  Top 0.61: P1.P15-21 P1.P15-22
N$7
  Top 0.61: P1.P16-21 P1.P16-22
N$8
  Top 0.61: P1.P17-21 P1.P17-22
N$9
  Top 0.61: P1.P18-21 P1.P18-22
N$10
  Top 0.61: P1.P19-21 P1.P19-22
N$11
  Top 0.61: P1.P20-21 P1.P20-22
N$12
  Top 0.61: P1.P21-21 P1.P21-22
N$13
  Top 0.61: P1.P22-21 P1.P22-22
N$14
  Top 0.61: P1.P23-21 P1.P23-22
N$15
  Top 0.61: P1.P24-21 P1.P24-22
N$16
  Top 0.61: P1.P25-21 P1.P25-22
VCC
  pour Bottom (isolate 0.406): -0.21,58.21 -0.21,-0.21 90.34,-0.21 90.34,58.21

### Text on the board
tPlace: PB10068-BLCPi